# EAGLE design schematic_rxtx_adapter (EAGLE 9.2.0)
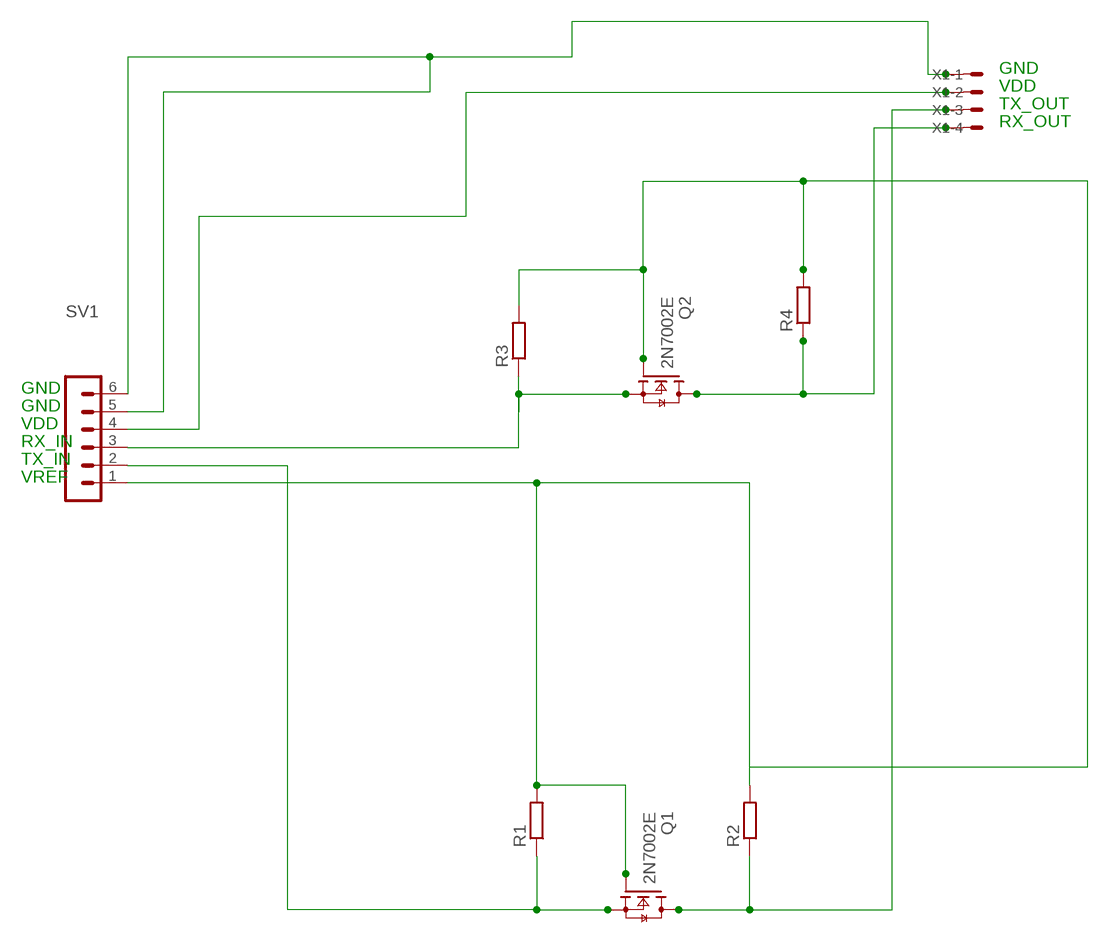
[diagram p0: schematic, sheet 1]

## Parts
Q1  2N7002E  [SOT23]
Q2  2N7002E  [SOT23]
R1  R-EU_0207/12  [0207/12]
R2  R-EU_0207/12  [0207/12]
R3  R-EU_0207/10  [0207/10]
R4  R-EU_0207/10  [0207/10]
SV1  MA06-1  [MA06-1]
X1  L04P  [L04P]

## Nets
GND: SV1.5 SV1.6 X1.1
RX_IN: Q2.2(S) R3.1 SV1.3
RX_OUT: Q2.3(D) R4.1 X1.4
TX_IN: Q1.2(S) R1.1 SV1.2
TX_OUT: Q1.3(D) R2.1 X1.3
VDD: SV1.4 X1.2
VREF: Q1.1(G) Q2.1(G) R1.2 R2.2 R3.2 R4.2 SV1.1

## Notes on the sheet
- GND
- VDD
- TX_OUT
- RX_OUT
- GND
- GND
- VDD
- RX_IN
- TX_IN
- VREF

## Library data of the parts
Q1 Q2 = nxp_60:2N7002: N-channel TrenchMOS FET N-channel enhancement mode Field-Effect Transistor (FET) in a plastic package using TrenchMOS technology. AAL Eindhoven MK
R1-R4 = rcl:R-EU_: RESISTOR, European symbol; SPICEPREFIX: R
SV1 = con-lstb:MA06-1: PIN HEADER; OC_FARNELL: unknown; OC_NEWARK: unknown
X1 = con-amp-mt:L04P: AMP MT CONNECTOR; OC_FARNELL: unknown; OC_NEWARK: unknown

## Board
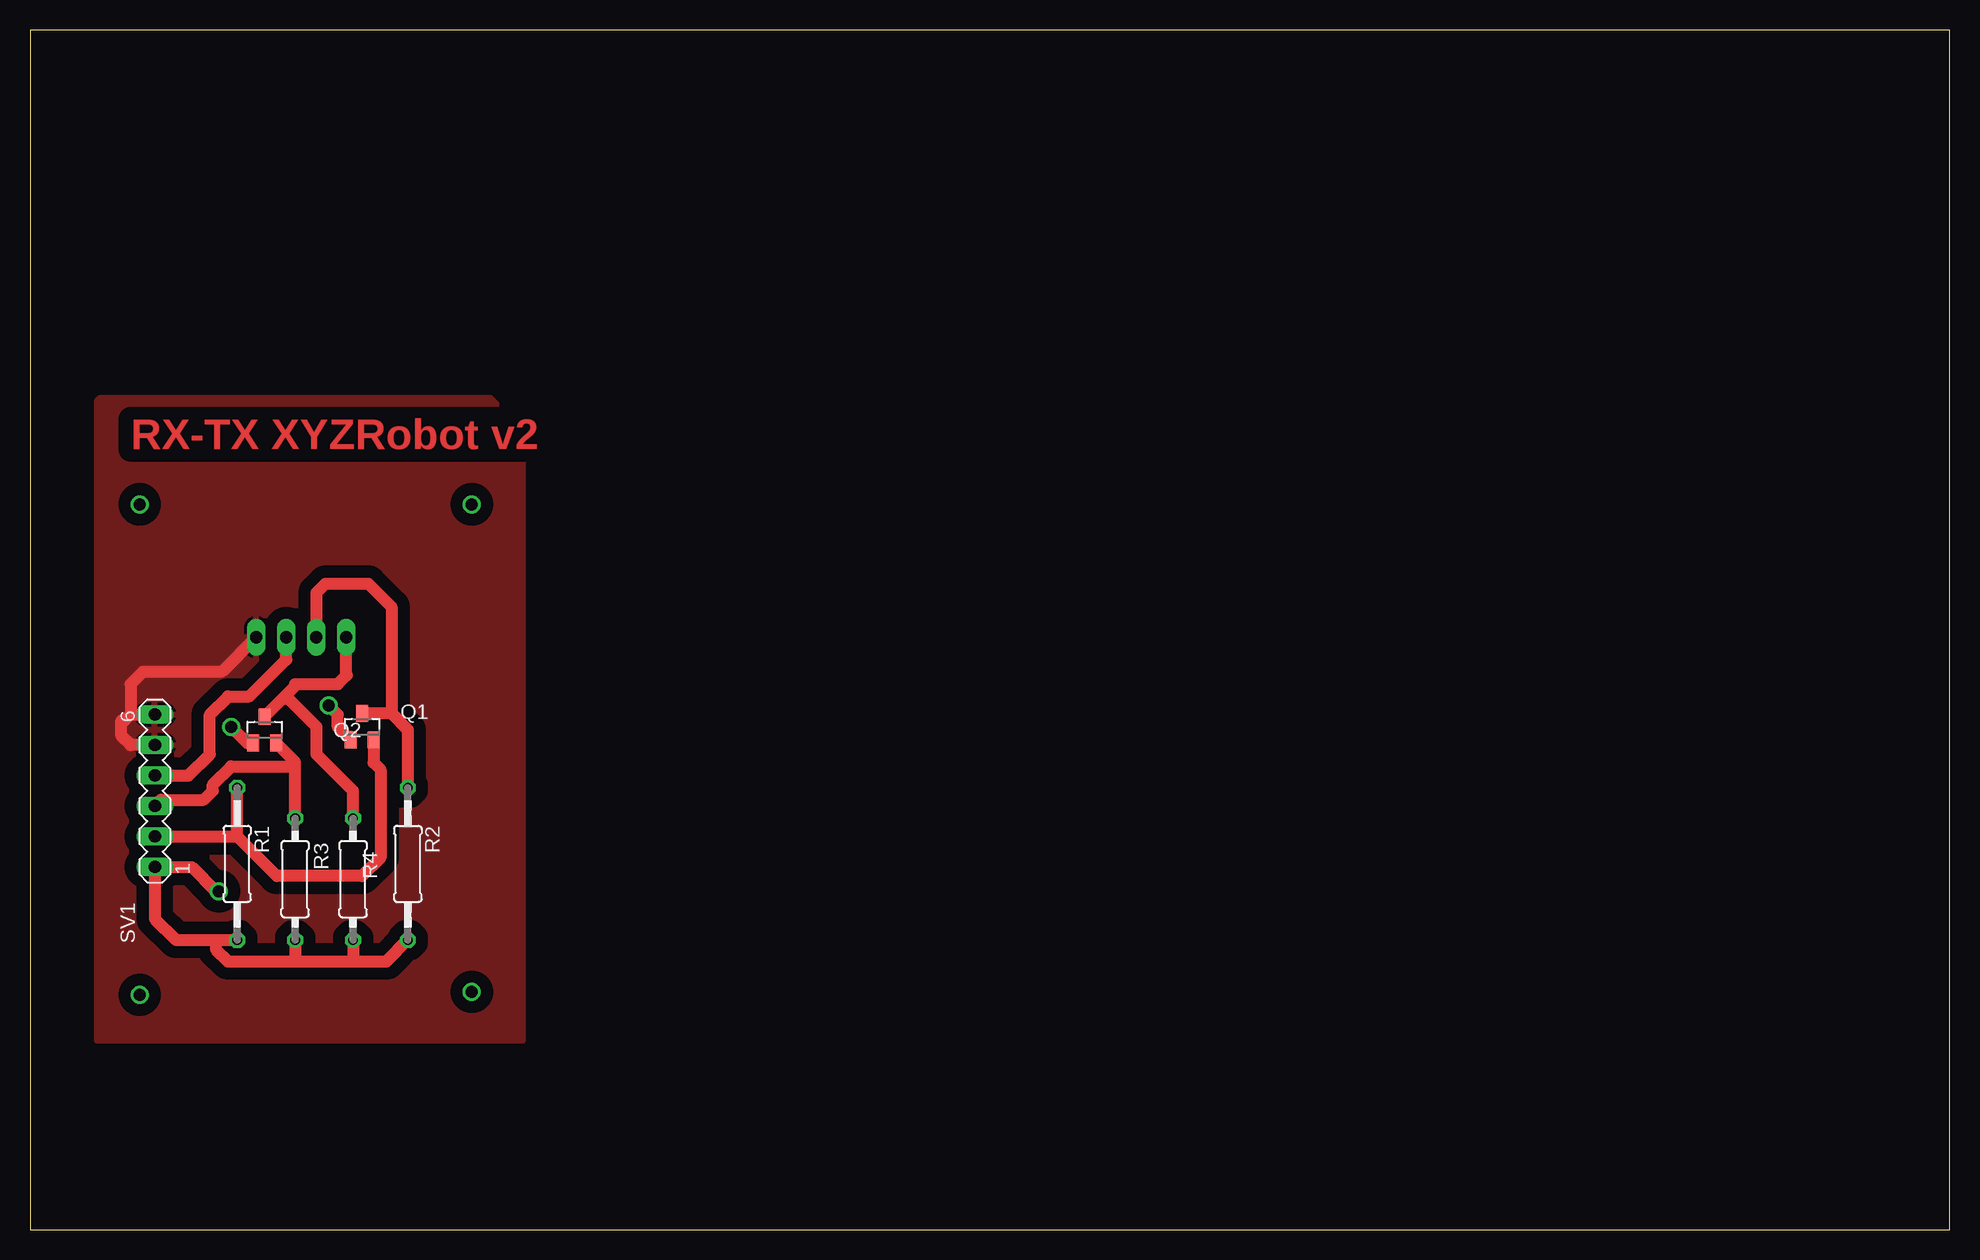
[diagram p1: board, top side]
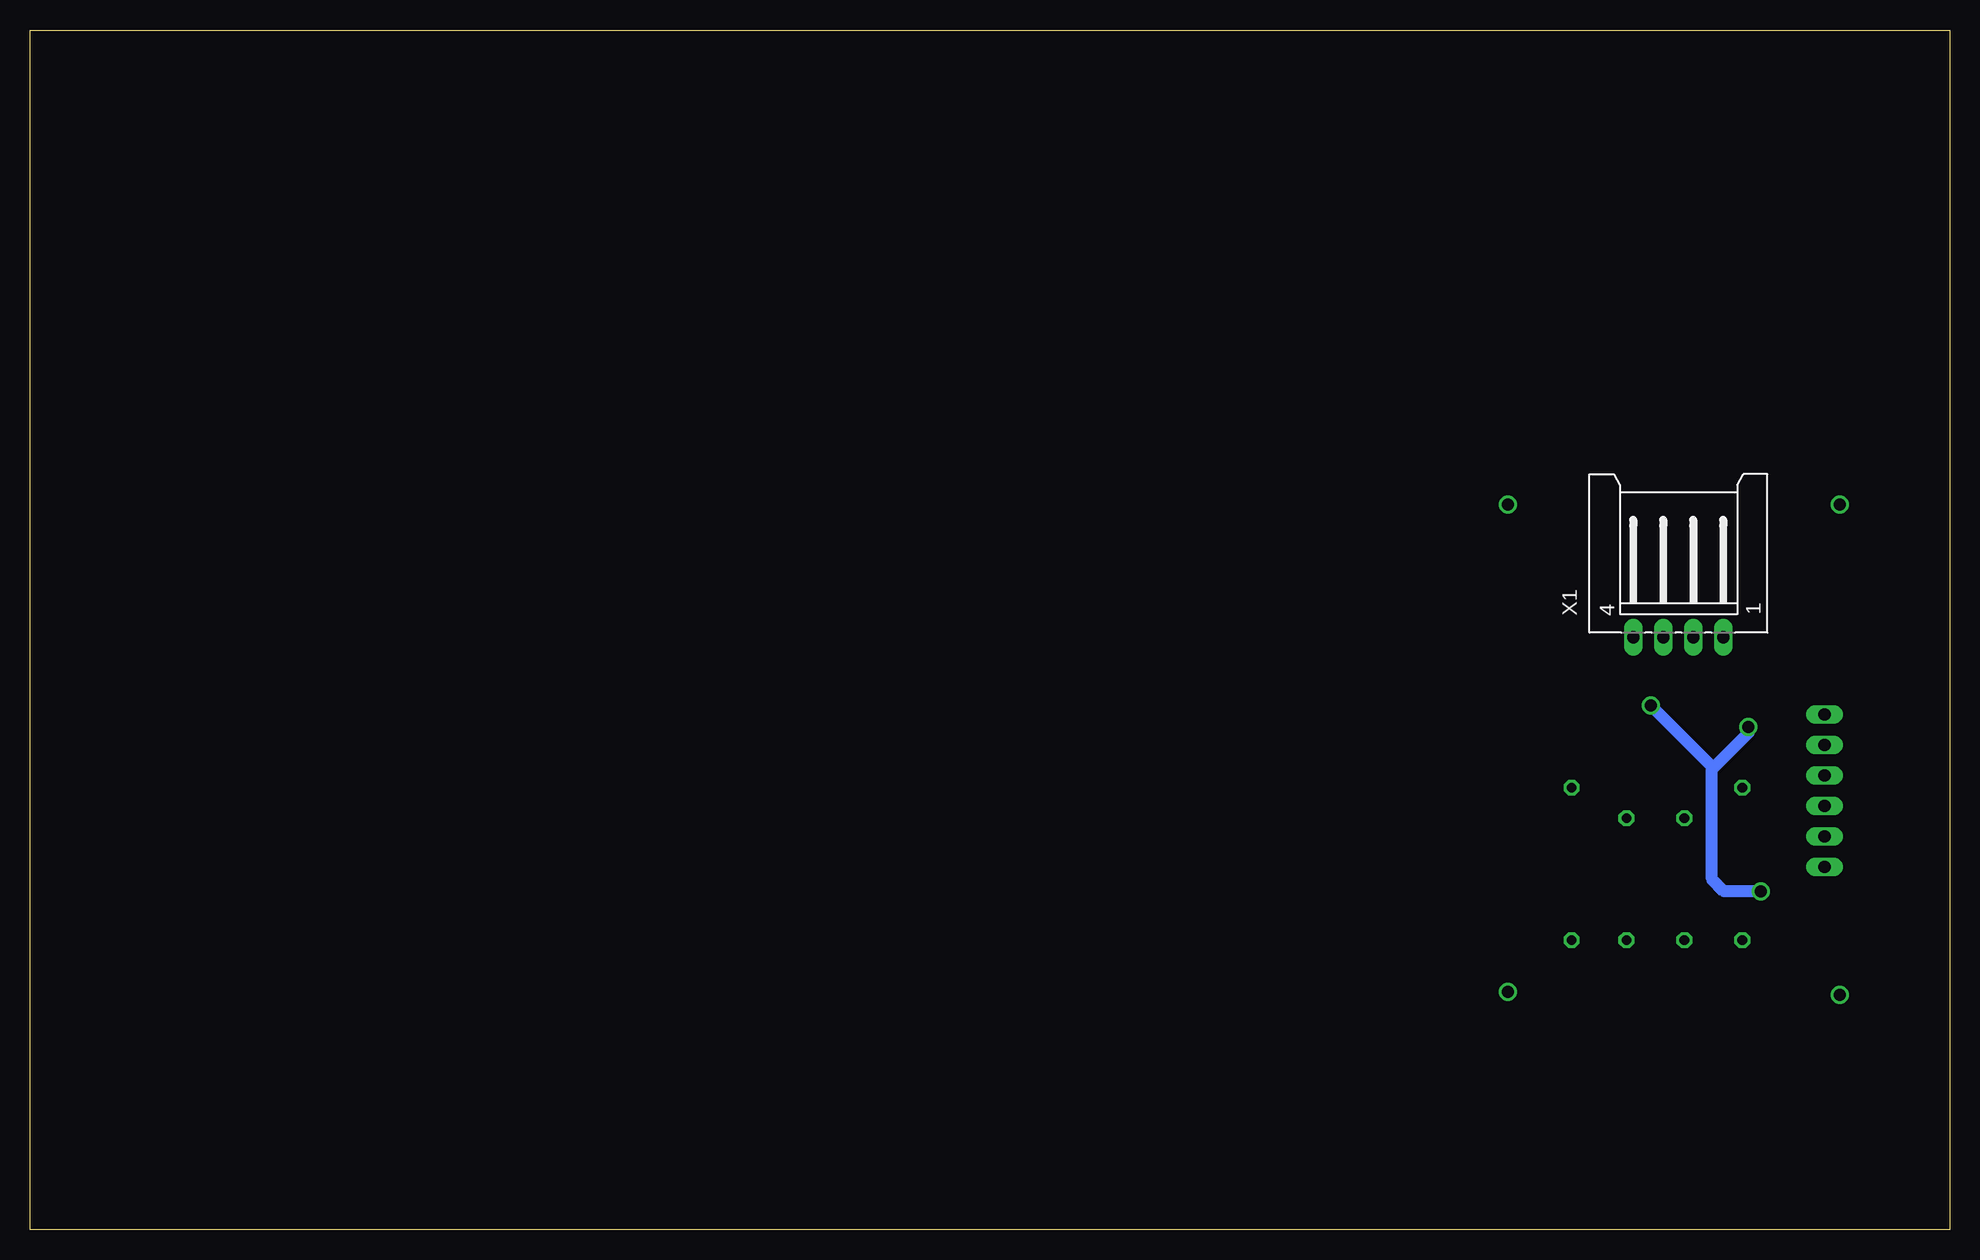
[diagram p2: board, bottom side, seen from below]

Size 160 x 100 mm. Coordinates in mm from the lower left corner, seen from the top.
Outline: 0,0 160,0 160,100 0,100 0,0
Copper layers (1*16): Top 0.035mm / dielectric 1.5mm / Bottom 0.035mm
Design rules "default": minimum track width 6mil, minimum drill 0.35mm, track to track 6mil, track to pad 6mil, pad to pad 6mil, via to via 6mil, smd to smd 6mil, copper to edge 40mil, drill to drill 6mil, minimum pad ring 10mil, minimum via ring 8mil, stop-mask expansion 4mil, vias tented up to drill 0mil, thermal gap 10mil

### Footprints (pad centres in the part's own frame; a part is rotated, then mirrored left to right if it is on the bottom)
SOT23 = smd 1 x 1.4: 1 -0.95,-1.1; 2 0.95,-1.1; 3 0,1.1
0207/12 = drill 0.813 octagon: 1 -6.35,0; 2 6.35,0
0207/10 = drill 0.813 octagon: 1 -5.08,0; 2 5.08,0
MA06-1 = drill 1.016 long: 1 -6.35,0; 2 -3.81,0; 3 -1.27,0; 4 1.27,0; 5 3.81,0; 6 6.35,0
L04P = drill 1.016 long: 1 3.75,-6.25; 2 1.25,-6.25; 3 -1.25,-6.25; 4 -3.75,-6.25

### Placement (x,y rotation side)
Q1  27.69,41.91 0 top
Q2  19.56,41.66 0 top
R1  17.27,30.48 270 top
R2  31.5,30.48 270 top
R3  22.1,29.21 270 top
R4  26.92,29.21 270 top
SV1  10.41,36.58 90 top
X1  22.61,55.63 0 bottom

### Tracks (layer width: path | path; a pad name or v marks a point on that pad's centre or on a via)
GND
  Top 1.016: SV1.5 8.38,40.39 7.62,41.15 7.62,42.42 7.87,42.42 8.38,42.93 | 8.38,42.93 SV1.6 | X1.1 15.96,46.48 9.4,46.48 8.38,45.47 8.38,42.93
  pour Top (isolate 1.016): 5.84,69.34 38.35,69.34 41.08,66.62 41.08,15.75 5.59,15.75 5.59,69.09
N$4  (via drill 1 pad 1.3)
  other vias: 36.83,60.45
N$9  (via drill 1 pad 1.3)
  other vias: 9.14,60.45
N$10  (via drill 1 pad 1.3)
  other vias: 9.14,19.56
N$11  (via drill 1 pad 1.3)
  other vias: 36.83,19.81
RX_IN
  Top 1.016: R3.1 22.1,38.35 | 22.1,38.35 22.1,38.97 Q2.2 | SV1.3 10.92,35.81 14.48,35.81 15.24,36.58 15.24,37.08 16.76,38.61 21.84,38.61 22.1,38.35
RX_OUT
  Top 1.016: X1.4 26.36,46.29 26.42,46.23 25.65,45.47 22.1,45.47 22.1,45.3 21.04,44.24 | Q2.3 21.04,44.24 | R4.1 26.92,36.58 23.88,39.62 23.88,41.91 21.55,44.24 21.04,44.24
TX_IN
  Top 1.016: Q1.2 28.64,38.93 29.21,38.35 29.21,30.99 27.69,29.46 20.57,29.46 17.27,32.77 | 17.27,32.77 R1.1 | SV1.2 17.27,32.77
TX_OUT
  Top 1.016: 30.14,43.01 Q1.3 | 30.14,43.01 31.5,41.66 R2.1 | X1.3 23.88,49.4 23.88,53.09 24.64,53.85 28.19,53.85 30.14,51.9 30.14,43.01
VDD
  Top 1.016: SV1.4 13.21,37.85 14.99,39.62 14.99,42.93 16.51,44.45 18.29,44.45 21.36,47.52 X1.2
VREF  (via drill 1 pad 1.3)
  Top 1.016: 15.49,24.13 12.19,24.13 10.41,25.91 SV1.1 13.46,30.23 15.49,28.19 v15.75,28.19 | 15.49,24.13 R1.2 | 15.49,24.13 15.49,23.37 16.51,22.35 22.1,22.35 | 22.1,22.35 27.18,22.35 | 27.18,22.35 29.72,22.35 R2.2 | R4.2 26.92,22.61 27.18,22.35 | R3.2 22.1,22.35 | 26.74,41.08 Q1.1 25.65,41.89 25.65,42.93 v24.89,43.69 | v16.76,41.91 18.12,40.56 Q2.1
  Bottom 1.016: v15.75,28.19 18.8,28.19 19.81,29.21 19.81,38.35 | 19.81,38.35 16.76,41.4 v16.76,41.91 | v24.89,43.69 19.81,38.61 19.81,38.35

### Text on the board
Top: RX-TX XYZRobot v2